# Altium schematic sheet I2C-NIXIE-CTRL.SchDoc: =ProjectTitle
size 420 x 297 mm; Address1: Address1; Address2: Address2; Address3: Address3; Address4: Address4; SheetNumber: 5; SheetTotal: 9; Scale: 1:1; DocumentType: Схема электрическая принципиальная
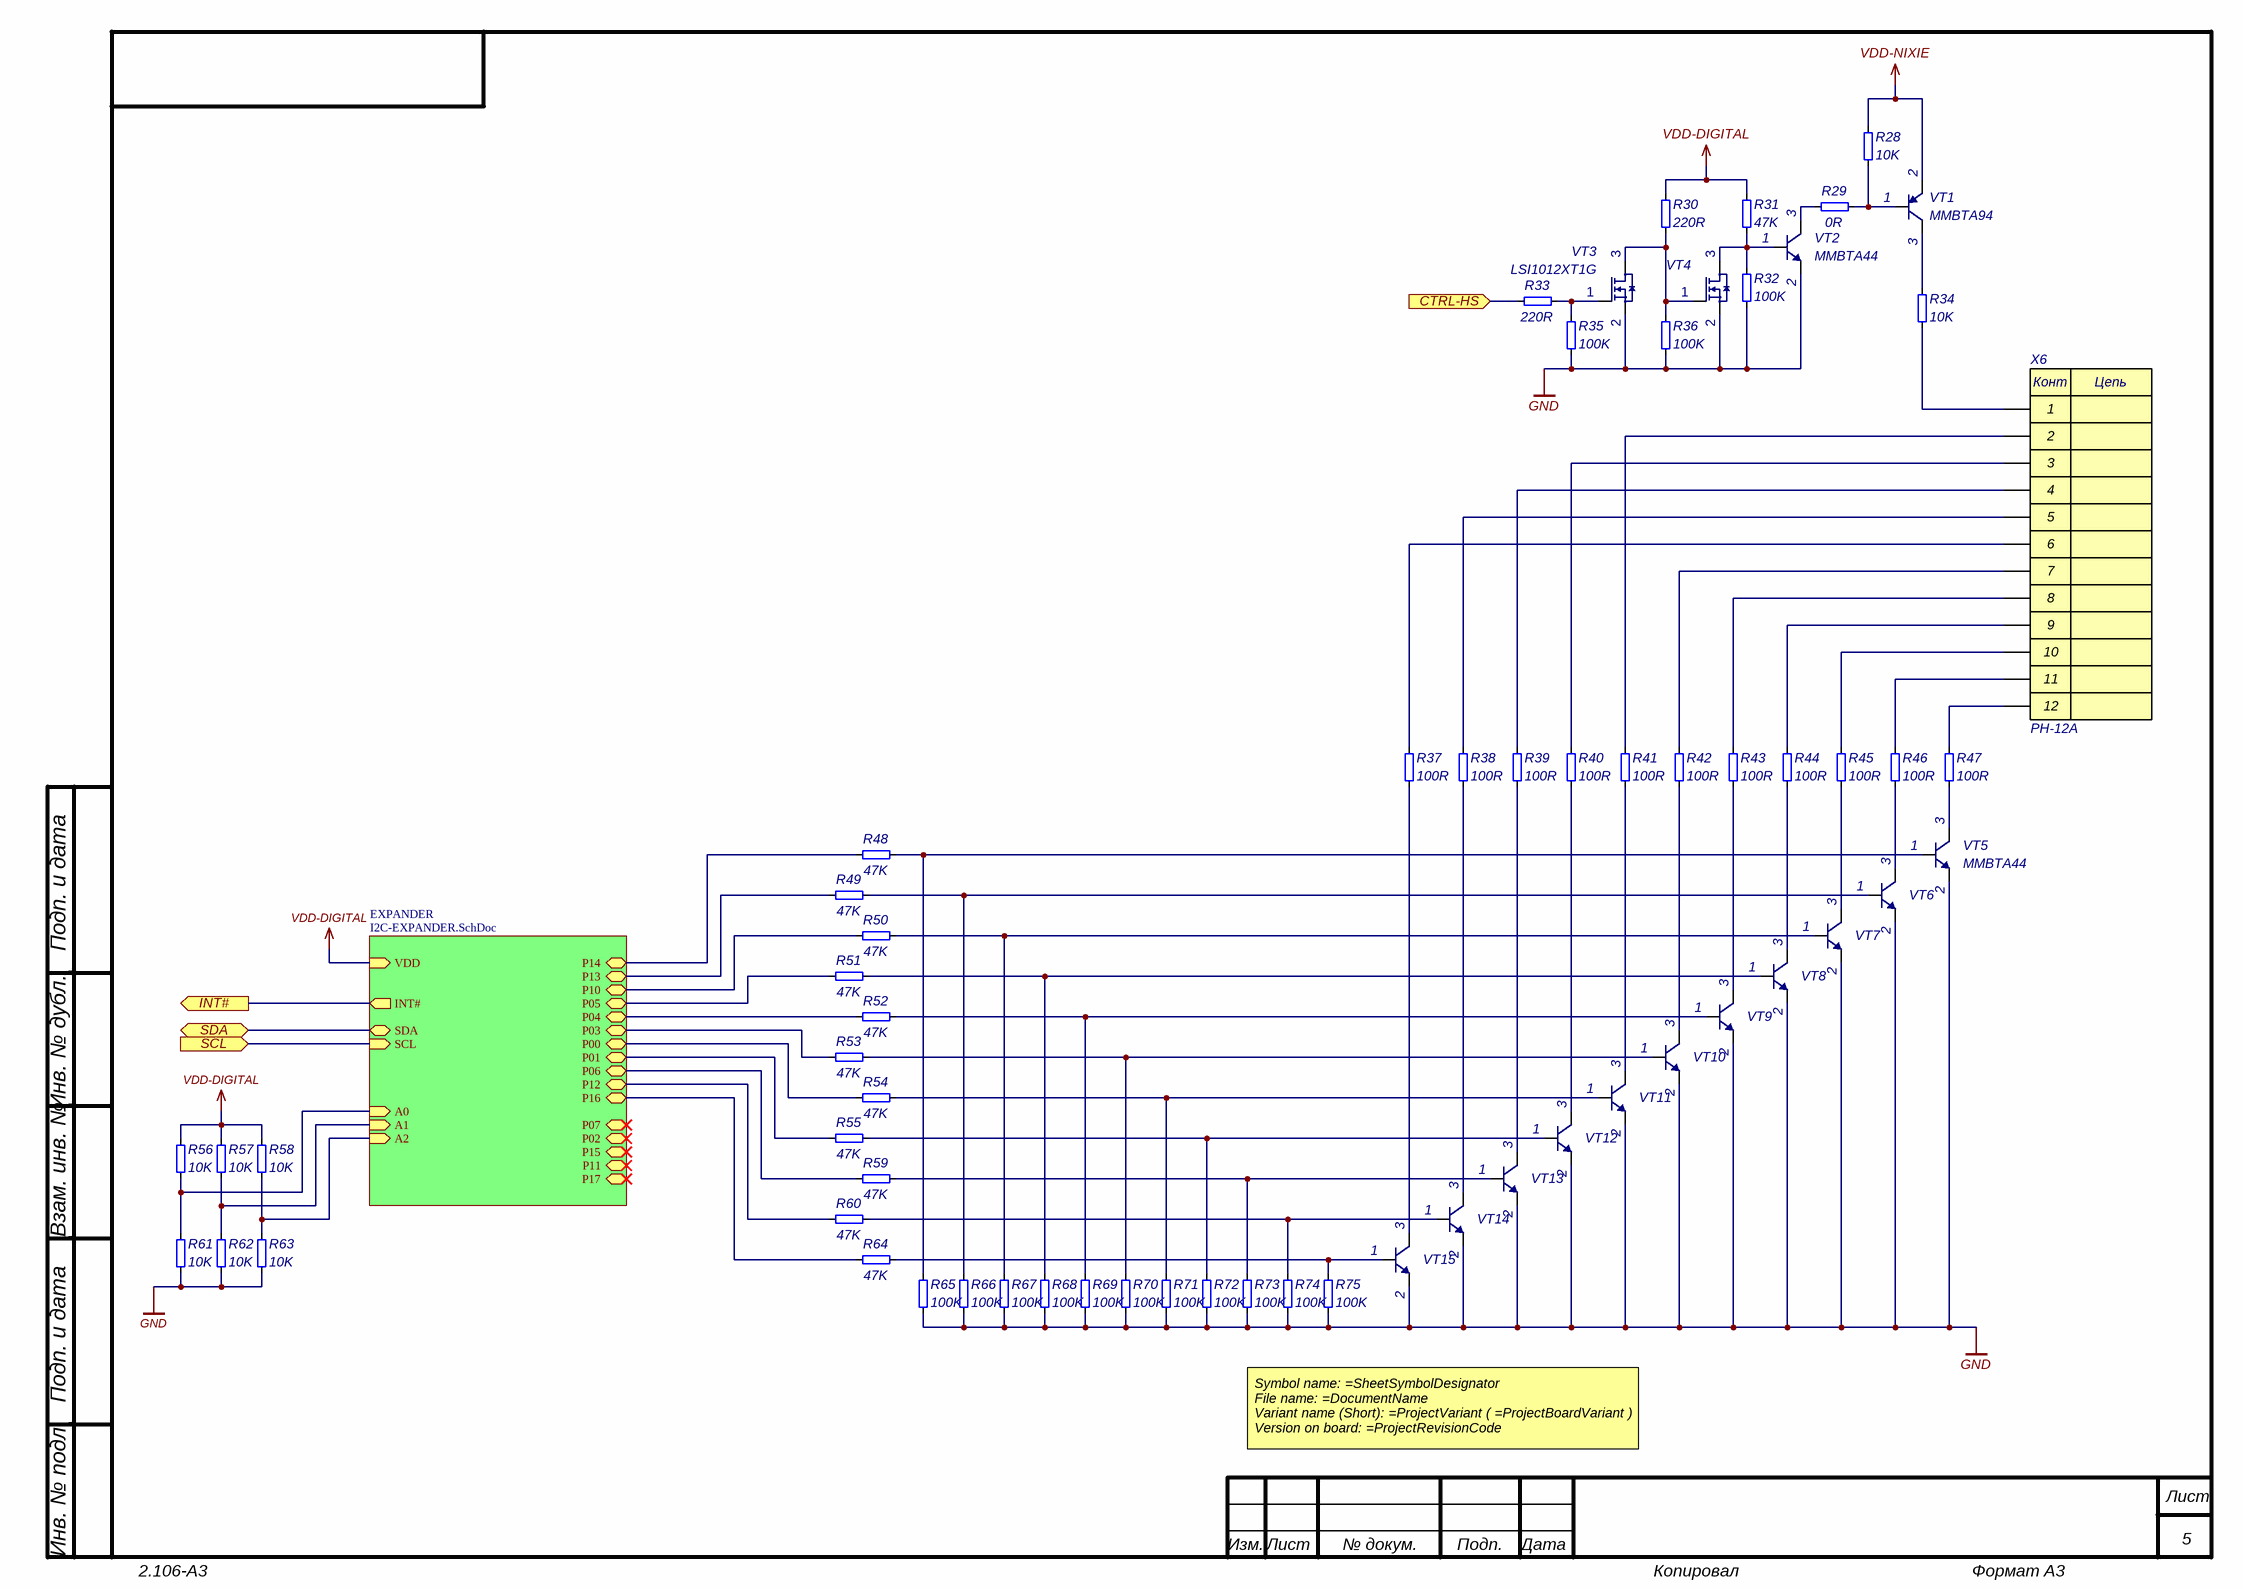
[diagram p0: I2C-NIXIE-CTRL.SchDoc]

## Parts
R28  10K  [R_0805]
R29  0R  [R_0805]
R30  220R  [R_0402]
R31  47K  [R_0402]
R32  100K  [R_0402]
R33  220R  [R_0402]
R34  10K  [R_0805]
R35  100K  [R_0402]
R36  100K  [R_0402]
R37  100R  [R_0805]
R38  100R  [R_0805]
R39  100R  [R_0805]
R40  100R  [R_0805]
R41  100R  [R_0805]
R42  100R  [R_0805]
R43  100R  [R_0805]
R44  100R  [R_0805]
R45  100R  [R_0805]
R46  100R  [R_0805]
R47  100R  [R_0805]
R48  47K  [R_0402]
R49  47K  [R_0402]
R50  47K  [R_0402]
R51  47K  [R_0402]
R52  47K  [R_0402]
R53  47K  [R_0402]
R54  47K  [R_0402]
R55  47K  [R_0402]
R56  10K  [R_0402]
R57  10K  [R_0402]
R58  10K  [R_0402]
R59  47K  [R_0402]
R60  47K  [R_0402]
R61  10K  [R_0402]
R62  10K  [R_0402]
R63  10K  [R_0402]
R64  47K  [R_0402]
R65  100K  [R_0402]
R66  100K  [R_0402]
R67  100K  [R_0402]
R68  100K  [R_0402]
R69  100K  [R_0402]
R70  100K  [R_0402]
R71  100K  [R_0402]
R72  100K  [R_0402]
R73  100K  [R_0402]
R74  100K  [R_0402]
R75  100K  [R_0402]
VT1  MMBTA94  [SOT23]
VT2  MMBTA44  [SOT23]
VT3  LSI1012XT1G  [SC-89]
VT4  LSI1012XT1G  [SC-89]  (value not drawn)
VT5  MMBTA44  [SOT23]
VT6  MMBTA44  [SOT23]  (value not drawn)
VT7  MMBTA44  [SOT23]  (value not drawn)
VT8  MMBTA44  [SOT23]  (value not drawn)
VT9  MMBTA44  [SOT23]  (value not drawn)
VT10  MMBTA44  [SOT23]  (value not drawn)
VT11  MMBTA44  [SOT23]  (value not drawn)
VT12  MMBTA44  [SOT23]  (value not drawn)
VT13  MMBTA44  [SOT23]  (value not drawn)
VT14  MMBTA44  [SOT23]  (value not drawn)
VT15  MMBTA44  [SOT23]  (value not drawn)
X6  PH-12A  [PH-12A]

## Sub-sheets
EXPANDER = I2C-EXPANDER.SchDoc: P00 (bidir), P01 (bidir), P02 (bidir), P03 (bidir), P04 (bidir), P05 (bidir), P06 (bidir), P07 (bidir), P10 (bidir), P11 (bidir), P12 (bidir), SDA (bidir), SCL (in), INT# (out), VDD (in), A0 (in), A1 (in), A2 (in), P13 (bidir), P14 (bidir), P15 (bidir), P16 (bidir), P17 (bidir)

## Ports
CTRL-HS (in), INT# (out), SCL (in), SDA (bidir)

## Nets
GND: R32.2 R35.2 R36.2 R61.1 R62.1 R63.1 R65.2 R66.2 R67.2 R68.2 R69.2 R70.2 R71.2 R72.2 R73.2 R74.2 R75.2 VT2.2(E) VT3.2(S) VT4.2(S) VT5.2(E) VT6.2(E) VT7.2(E) VT8.2(E) VT9.2(E) VT10.2(E) VT11.2(E) VT12.2(E) VT13.2(E) VT14.2(E) VT15.2(E)
VDD-DIGITAL: R30.1 R31.1 R56.2 R57.2 R58.2 ; sheet EXPANDER/VDD
VDD-NIXIE: R28.1 VT1.2(E)
CTRL-HS: R33.1 ; port CTRL-HS
INT#: port INT#, sheet EXPANDER/INT#
SCL: port SCL, sheet EXPANDER/SCL
SDA: port SDA, sheet EXPANDER/SDA
NetR28_2: R28.2 R29.2 VT1.1(B)
NetR29_1: R29.1 VT2.3(C)
NetR30_2: R30.2 R36.1 VT3.3(D) VT4.1(G)
NetR31_2: R31.2 R32.1 VT2.1(B) VT4.3(D)
NetR33_2: R33.2 R35.1 VT3.1(G)
NetR34_1: R34.1 VT1.3(C)
NetR34_2: R34.2 X6.1
NetR37_1: R37.1 X6.6
NetR37_2: R37.2 VT15.3(C)
NetR38_1: R38.1 X6.5
NetR38_2: R38.2 VT14.3(C)
NetR39_1: R39.1 X6.4
NetR39_2: R39.2 VT13.3(C)
NetR40_1: R40.1 X6.3
NetR40_2: R40.2 VT12.3(C)
NetR41_1: R41.1 X6.2
NetR41_2: R41.2 VT11.3(C)
NetR42_1: R42.1 X6.7
NetR42_2: R42.2 VT10.3(C)
NetR43_1: R43.1 X6.8
NetR43_2: R43.2 VT9.3(C)
NetR44_1: R44.1 X6.9
NetR44_2: R44.2 VT8.3(C)
NetR45_1: R45.1 X6.10
NetR45_2: R45.2 VT7.3(C)
NetR46_1: R46.1 X6.11
NetR46_2: R46.2 VT6.3(C)
NetR47_1: R47.1 X6.12
NetR47_2: R47.2 VT5.3(C)
NetR48_1: R48.1 ; sheet EXPANDER/P14
NetR48_2: R48.2 R65.1 VT5.1(B)
NetR49_1: R49.1 ; sheet EXPANDER/P13
NetR49_2: R49.2 R66.1 VT6.1(B)
NetR50_1: R50.1 ; sheet EXPANDER/P10
NetR50_2: R50.2 R67.1 VT7.1(B)
NetR51_1: R51.1 ; sheet EXPANDER/P05
NetR51_2: R51.2 R68.1 VT8.1(B)
NetR52_1: R52.1 ; sheet EXPANDER/P04
NetR52_2: R52.2 R69.1 VT9.1(B)
NetR53_1: R53.1 ; sheet EXPANDER/P03
NetR53_2: R53.2 R70.1 VT10.1(B)
NetR54_1: R54.1 ; sheet EXPANDER/P00
NetR54_2: R54.2 R71.1 VT11.1(B)
NetR55_1: R55.1 ; sheet EXPANDER/P01
NetR55_2: R55.2 R72.1 VT12.1(B)
NetR56_1: R56.1 R61.2 ; sheet EXPANDER/A0
NetR57_1: R57.1 R62.2 ; sheet EXPANDER/A1
NetR58_1: R58.1 R63.2 ; sheet EXPANDER/A2
NetR59_1: R59.1 ; sheet EXPANDER/P06
NetR59_2: R59.2 R73.1 VT13.1(B)
NetR60_1: R60.1 ; sheet EXPANDER/P12
NetR60_2: R60.2 R74.1 VT14.1(B)
NetR64_1: R64.1 ; sheet EXPANDER/P16
NetR64_2: R64.2 R75.1 VT15.1(B)

## Notes on the sheet
- Подп. и дата
- Инв. № дубл.
- Взам. инв. №
- Symbol name: =SheetSymbolDesignator
  File name: =DocumentName
  Variant name (Short): =ProjectVariant ( =ProjectBoardVariant )
  Version on board: =ProjectRevisionCode
- Инв. № подл.
- Изм.
- Лист
- № докум.
- Подп.
- Дата
- 2.106-A3
- Копировал
- Формат А3
- (in symbol PH-12A) Конт; Цепь

## Library data of the parts
R28 R34 = 0805-0.125W-10K-200ppm±1%: NameFromManufacturer: RC0805FR-0710KL; Manufacturer: Yageo; Place: T; Tolerance: 1%; Check: False; Part Number: 0805-0.125W-10K-200ppm±1%; Value: 10K; Temperature: -55°C~155°C; ComponentLink1Description: DATASHEET; ComponentLink1URL: https://static.chipdip.ru/lib/175/DOC011175144.pdf; Datasheet: Datasheets/resistors/PYu-RC_Group_51_RoHS_L_11.pdf; Last changed: 22.01.2024
R29 = 0805-0.125W-0R-250ppm±5%: NameFromManufacturer: RC0805JR-070RL; Manufacturer: Yageo; Place: S; Tolerance: 5%; Check: False; Part Number: 0805-0.125W-0R-250ppm±5%; Value: 0R; Temperature: -55°C~155°C; ComponentLink1Description: DATASHEET; ComponentLink1URL: https://www.terraelectronica.ru/product/327233; Datasheet: Datasheets/resistors/PYu-RC_Group_51_RoHS_L_11.pdf; Last changed: 27.10.2022
R30 R33 = 0402-0.0625W-220R-100ppm±1%: NameFromManufacturer: RC0402FR-07220RL; Manufacturer: Yageo; Place: S; Tolerance: 1%; Check: False; Part Number: 0402-0.0625W-220R-100ppm±1%; Value: 220R; Temperature: -55°C~155°C; ComponentLink1Description: DATASHEET; ComponentLink1URL: https://octopart.com/rc0402jr-07220rl-yageo-40254879?r=sp#Specs; Datasheet: Datasheets/resistors/RC0402.pdf; Last changed: 28.03.2023
R31 R48-R55 R59 R60 R64 = 0402-0.0625W-47K-100ppm±1%: NameFromManufacturer: RC0402FR-0747KL; Manufacturer: Yageo; Place: S; Tolerance: 1%; Check: False; Part Number: 0402-0.0625W-47K-100ppm±1%; Value: 47K; Temperature: -55°C~155°C; ComponentLink1Description: DATASHEET; ComponentLink1URL: https://www.terraelectronica.ru/pdf/show?pdf_file=%252Fds%252Fpdf%252FR%252FRC0402.pdf; Datasheet: Datasheets/resistors/PYu-RC_Group_51_RoHS_L_12.pdf; Last changed: 27.10.2022
R32 R35 R36 R65-R75 = 0402-0.0625W-100K-100ppm±1%: NameFromManufacturer: RC0402FR-07100KL; Manufacturer: Yageo; Place: S; Tolerance: 1%; Check: False; Part Number: 0402-0.0625W-100K-100ppm±1%; Value: 100K; Temperature: -55°C~155°C; ComponentLink1Description: DATASHEET; ComponentLink1URL: https://www.yageo.com/upload/media/product/productsearch/datasheet/rchip/PYu-RC_Group_51_RoHS_L_11.pdf; Datasheet: Datasheets/resistors/PYu-RC_Group_51_RoHS_L_11.pdf; Last changed: 27.10.2022
R37-R47 = 0805-0.125W-100R-100ppm±1%: *; NameFromManufacturer: RC0805FR-07100RL; Manufacturer: Yageo; Place: S; Tolerance: 1%; Check: False; Part Number: 0805-0.125W-100R-100ppm±1%; Value: 100R; Temperature: -55°C~125°C; ComponentLink1Description: DATASHEET; ComponentLink1URL: https://eu.mouser.com/ProductDetail/YAGEO/RC0805FR-07100RL?qs=8Y8p%252BasKcI6MtXUgG4E6SQ%3D%3D; Datasheet: Datasheets/resistors/PYu-RC_Group_51_RoHS_L_11.pdf; Last changed: 27.10.2022
R56-R58 R61-R63 = 0402-0.0625W-10K-100ppm±1%: NameFromManufacturer: RC0402FR-0710KL; Manufacturer: Yageo; Place: S; Tolerance: 1%; Check: False; Part Number: 0402-0.0625W-10K-100ppm±1%; Value: 10K; Temperature: -55°C~155°C; ComponentLink1Description: DATASHEET; ComponentLink1URL: https://ru.mouser.com/ProductDetail/YAGEO/RC0402FR-0710KL?qs=%2Fha2pyFaduhjtLcYvKXQ8IogF7YwN7YtH%252BOO8ZtEEMnoa4yoWYcwpw%3D%3D; Datasheet: Datasheets/resistors/PYu-RC_Group_51_RoHS_L_11.pdf; Last changed: 27.10.2022
VT1 = MMBTA94: 400V 350mW 300mA PNP SOT-23 Bipolar Transistor; Manufacturer: PJSEMI; Place: T; Check: False; Part Number: MMBTA94; Voltage: 400V; Value: MMBTA94; Temperature: -55°C~150°C; ComponentLink1Description: DATASHEET; NameFromManufacturer: MMBTA94; ComponentLink1URL: https://www.lcsc.com/product-detail/Bipolar-Transistors-BJT_PJSEMI-MMBTA94_C411780.html; Last changeв: 21.01.2024
VT2 VT5-VT15 = MMBTA44: 400V 350mW 300mA NPN SOT-23 Bipolar Transistor; Manufacturer: PJSEMI; Place: T; Check: False; Part Number: MMBTA44; Voltage: 400V; Value: MMBTA44; Temperature: -55°C~150°C; ComponentLink1Description: DATASHEET; NameFromManufacturer: MMBTA44; ComponentLink1URL: https://www.lcsc.com/product-detail/Bipolar-Transistors-BJT_PJSEMI-MMBTA44_C411777.html; Last changeв: 21.01.2024
VT3 VT4 = LSI1012XT1G: 20V 500mA 250mW, 900mV@250uA N Channel SC-89 MOSFET; Manufacturer: LRC; Place: T; Check: False; Part Number: LSI1012XT1G; Voltage: 20V; Value: LSI1012XT1G; Temperature: -55°C~150°C; ComponentLink1Description: DATASHEET; NameFromManufacturer: LSI1012XT1G; ComponentLink1URL: https://www.lcsc.com/product-detail/MOSFETs_LRC-LSI1012XT1G_C383275.html; Last changeв: 11.03.2024
X6 = PH-12A: 12P PH 2mm 3A Straight P=2mm; Manufacturer: HCTL; Place: T; Check: False; Part Number: PH-12A; Value: PH-12A; Temperature: -20°C~85°C; ComponentLink1Description: DATASHEET; NameFromManufacturer: PH-12A; ComponentLink1URL: https://www.lcsc.com/product-detail/Wire-To-Board-Wire-To-Wire-Connector_HCTL-PH-12A_C2908633.html; Last changed: 21.01.2024